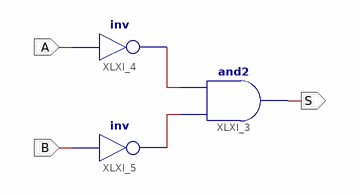
[diagram p0: schematic sheet 1]
// Xilinx ISE schematic ComparadorMenor.sch (xa9500xl) as structural Verilog: 3 symbols, 3 ports
module ComparadorMenor (
  input  A,
  input  B,
  output S
);

  wire XLXN_3, XLXN_4;

  and XLXI_3 (S, XLXN_3, XLXN_4);
  not XLXI_4 (XLXN_4, A);
  not XLXI_5 (XLXN_3, B);
endmodule
